# Altium schematic sheet top.SchDoc
size A4; DocumentNumber: 1; SheetNumber: 1; SheetTotal: 9
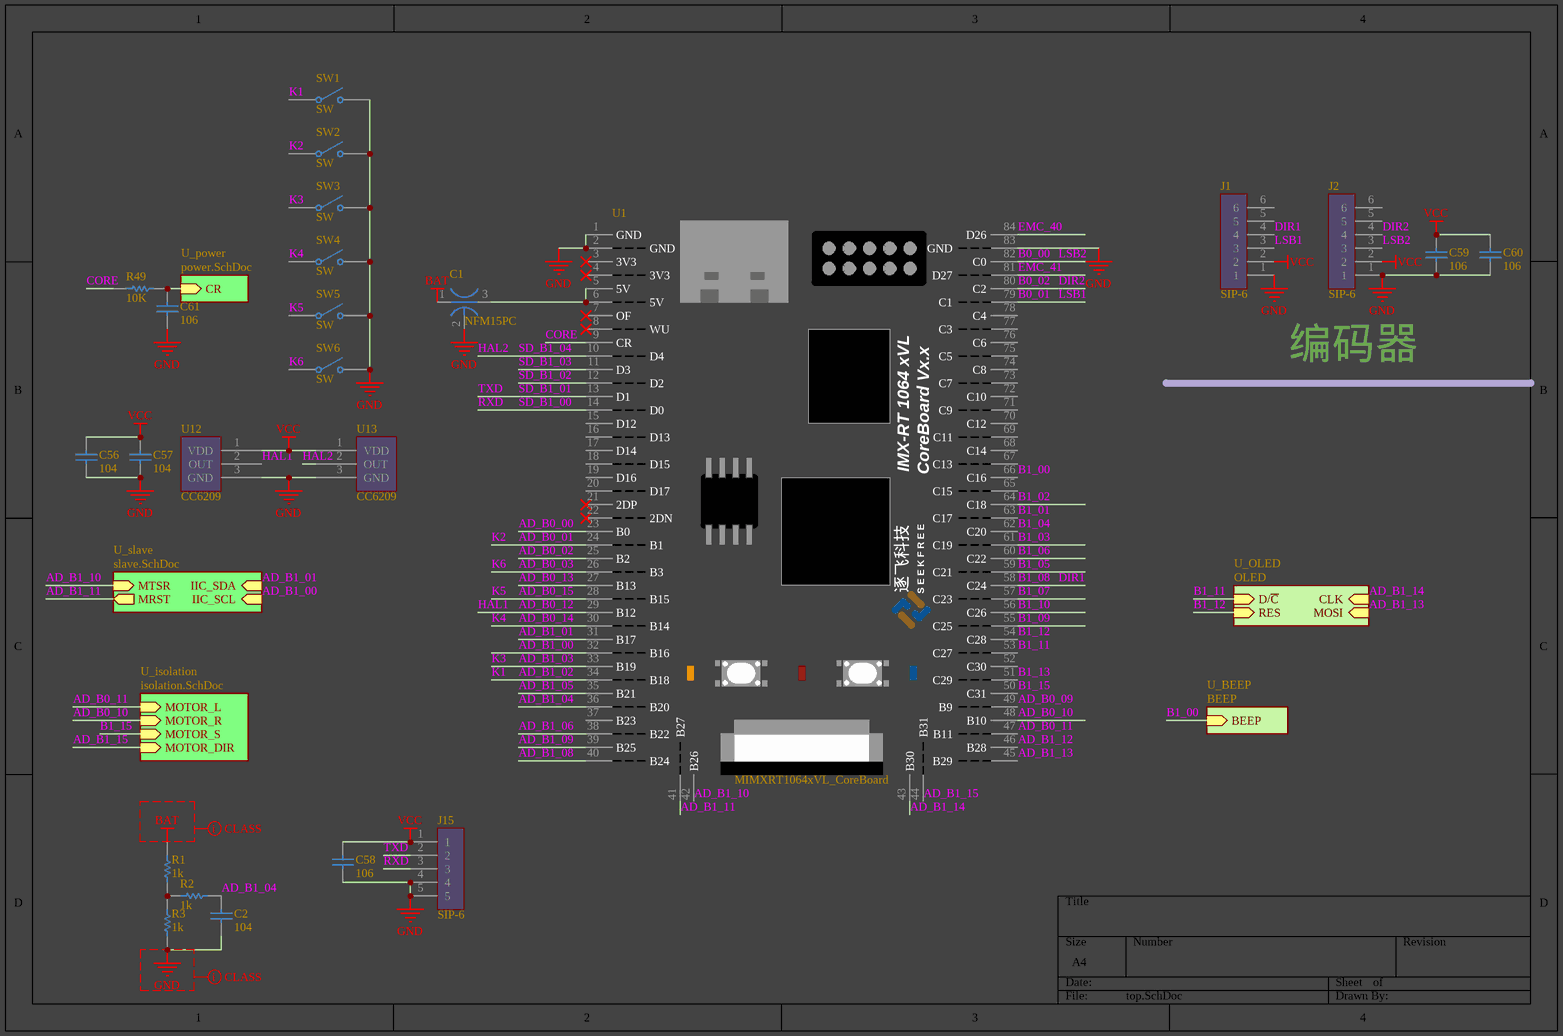
[diagram p0: top.SchDoc]

## Parts
C1  NFM15PC  [FILTER-SMD_3P-L1.0-W0.5-L]
C2  104  [C0603]
C56  104  [C0603]
C57  104  [C0603]
C58  106  [C0603]
C59  106  [C0603]
C60  106  [C0603]
C61  106  [C0603]
J1  SIP-6  [2.54简易牛角座6P]
J2  SIP-6  [2.54简易牛角座6P]
J15  SIP-6  [2.54排针1X5]
R1  1k  [R0603]
R2  1k  [R0603]
R3  1k  [R0603]
R49  10K  [R0603]
SW1  SW  [KEY-SMD_4P-L4.2-W3.2-P2.20-LS4.6]
SW2  SW  [KEY-SMD_4P-L4.2-W3.2-P2.20-LS4.6]
SW3  SW  [KEY-SMD_4P-L4.2-W3.2-P2.20-LS4.6]
SW4  SW  [KEY-SMD_4P-L4.2-W3.2-P2.20-LS4.6]
SW5  SW  [KEY-SMD_4P-L4.2-W3.2-P2.20-LS4.6]
SW6  SW  [KEY-SMD_4P-L4.2-W3.2-P2.20-LS4.6]
U1  MIMXRT1064xVL_CoreBoard  [MIMXRT1064xVL_CoreBoard]
U12  CC6209  [SOT-23]
U13  CC6209  [SOT-23]

## Sub-sheets
U_BEEP = BEEP: BEEP (in)
U_isolation = isolation.SchDoc: MOTOR_L (in), MOTOR_R (in), MOTOR_S (in), MOTOR_DIR (in)
U_OLED = OLED: D/~{C} (in), RES (in), CLK (in), MOSI (in)
U_power = power.SchDoc: CR (in)
U_slave = slave.SchDoc: MTSR (in), MRST (out), IIC_SDA (in), IIC_SCL (in)

## Nets
BAT: C1.1(IN) R1.2
GND: C1.2(GND) C2.1 C56.1 C57.1 C58.1 C59.1 C60.1 C61.1 J1.1 J2.1 J15.4 J15.5 R3.1 SW1.2(NO) SW2.2(NO) SW3.2(NO) SW4.2(NO) SW5.2(NO) SW6.2(NO) U1.1(GND) U1.2(GND) U1.83(GND) U12.3(GND) U13.3(GND)
VCC: C56.2 C57.2 C58.2 C59.2 C60.2 J1.2 J2.2 J15.1 U12.1(VDD) U13.1(VDD)
AD_B0_00: U1.23(B0)
AD_B0_01: SW2.1(COMMON) U1.24(B1)  [also labelled K2]
AD_B0_02: U1.25(B2)
AD_B0_03: SW6.1(COMMON) U1.26(B3)  [also labelled K6]
AD_B0_09: U1.49(B9)
AD_B0_10: U1.48(B10) ; sheet U_isolation/MOTOR_R
AD_B0_11: U1.47(B11) ; sheet U_isolation/MOTOR_L
AD_B0_12: U1.29(B12) U12.2(OUT)  [also labelled HAL1]
AD_B0_13: U1.27(B13)
AD_B0_14: SW4.1(COMMON) U1.30(B14)  [also labelled K4]
AD_B0_15: SW5.1(COMMON) U1.28(B15)  [also labelled K5]
AD_B1_00: U1.32(B16) ; sheet U_slave/IIC_SCL
AD_B1_01: U1.31(B17) ; sheet U_slave/IIC_SDA
AD_B1_02: SW1.1(COMMON) U1.34(B18)  [also labelled K1]
AD_B1_03: SW3.1(COMMON) U1.33(B19)  [also labelled K3]
AD_B1_04: C2.2 R2.1 U1.36(B20)
AD_B1_05: U1.35(B21)
AD_B1_06: U1.38(B22)
AD_B1_08: U1.40(B24)
AD_B1_09: U1.39(B25)
AD_B1_10: U1.42(B26) ; sheet U_slave/MTSR
AD_B1_11: U1.41(B27) ; sheet U_slave/MRST
AD_B1_12: U1.46(B28)
AD_B1_13: U1.45(B29) ; sheet U_OLED/MOSI
AD_B1_14: U1.43(B30) ; sheet U_OLED/CLK
AD_B1_15: U1.44(B31) ; sheet U_isolation/MOTOR_DIR
B0_00: J2.3 U1.82(C0)  [also labelled LSB2]
B0_01: J1.3 U1.79(C1)  [also labelled LSB1]
B0_02: J2.4 U1.80(C2)  [also labelled DIR2]
B1_00: U1.66(C16) ; sheet U_BEEP/BEEP
B1_01: U1.63(C17)
B1_02: U1.64(C18)
B1_03: U1.61(C19)
B1_04: U1.62(C20)
B1_05: U1.59(C21)
B1_06: U1.60(C22)
B1_07: U1.57(C23)
B1_08: J1.4 U1.58(C24)  [also labelled DIR1]
B1_09: U1.55(C25)
B1_10: U1.56(C26)
B1_11: U1.53(C27) ; sheet U_OLED/D/~{C}
B1_12: U1.54(C28) ; sheet U_OLED/RES
B1_13: U1.51(C29)
B1_15: U1.50(C31) ; sheet U_isolation/MOTOR_S
CORE: R49.2 U1.9(CR)
EMC_40: U1.84(D26)
EMC_41: U1.81(D27)
HAL2: U1.10(D4) U13.2(OUT)  [also labelled SD_B1_04]
RXD: J15.3 U1.14(D0)  [also labelled SD_B1_00]
SD_B1_01: J15.2 U1.13(D1)  [also labelled TXD]
SD_B1_02: U1.12(D2)
SD_B1_03: U1.11(D3)
NetC1_3: C1.3(OUT) U1.5(5V) U1.6(5V)
NetC61_2: C61.2 R49.1 ; sheet U_power/CR
NetR1_1: R1.1 R2.2 R3.2

Not connected (* = marked no-connect by the designer): J1 5 6; J2 5 6; U1 3(3V3)* 4(3V3)* 7(OF)* 8(WU)* 15(D12) 16(D13) 17(D14) 18(D15) 19(D16) 20(D17) 21(2DP)* 22(2DN)* 37(B23) 52(C30) 65(C15) 67(C13) 68(C14) 69(C11) 70(C12) 71(C9) 72(C10) 73(C7) 74(C8) 75(C5) 76(C6) 77(C3) 78(C4)

## Layout directives
net class POW: BAT
net class GND: GND

## Notes on the sheet
- 编码器
- Title
- Size:
- Date:
- A4
- Number:
- Time:
- Revision:
- Sheet
- of
- File:
- (in symbol MIMXRT1064xVL_CoreBoard) IMX-RT 1064 xVL; CoreBoard Vx.x; 逐飞科技; S E E K F R E E

## Library data of the parts
C1 = 陶瓷滤波器: BOM_Manufacturer: Murata Electronics; BOM_Manufacturer Part: NFM15PC473C1C3D; Capacitance: 47nF; Contributor: LCSC; BOM_Supplier: LCSC; BOM_Supplier Part: C162672; spicePre: U; spiceSymbolName: NFM15PC473C1C3D
C2 C56-C61 = 电容: Capacitor; Value: 22pF; Published: 8-Jun-2000; LatestRevisionDate: 17-Jul-2002; LatestRevisionNote: Re-released for DXP Platform.; PackageReference: RAD-0.3; Publisher: Altium Limited; PackageDescription: Radial Cap, Thru-Hole; 2 Leads; 0.3 in Pin Spacing
J15 = SIP-5
R1-R3 R49 = 电阻: Resistor; Value: 150R; Published: 8-Jun-2000; LatestRevisionDate: 17-Jul-2002; LatestRevisionNote: Re-released for DXP Platform.; PackageReference: AXIAL-0.3; Publisher: Altium Limited; PackageDescription: Axial Device, Thru-Hole; 2 Leads; 0.3 in Pin Spacing
SW1-SW6 = Switch: Single-Pole, Single-Throw Switch
U1 = MIMXRT1064xVL_CoreBoard: 逐飞科技i.MX RT1064核心板整体原理，可直接使用
U12 U13 = 霍尔开关